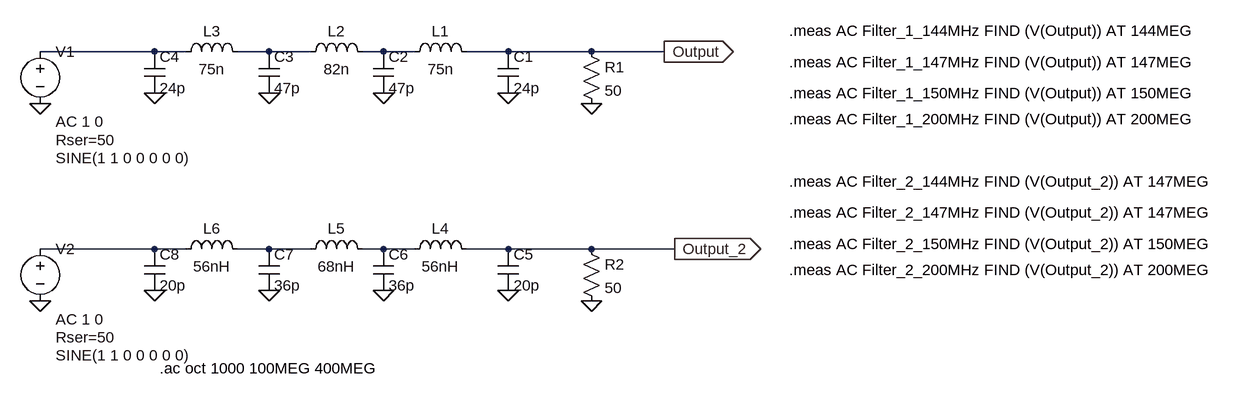
[diagram p0: schematic FilterModel.asc]
FilterModel.asc, the LTspice schematic file:
Version 4
SHEET 1 1464 680
WIRE -224 64 -400 64
WIRE -176 64 -224 64
WIRE -48 64 -96 64
WIRE 16 64 -48 64
WIRE 128 64 96 64
WIRE 176 64 128 64
WIRE 320 64 256 64
WIRE 448 64 320 64
WIRE 560 64 448 64
WIRE -224 368 -400 368
WIRE -176 368 -224 368
WIRE -48 368 -96 368
WIRE 16 368 -48 368
WIRE 128 368 96 368
WIRE 176 368 128 368
WIRE 320 368 256 368
WIRE 448 368 320 368
WIRE 576 368 448 368
FLAG 320 128 0
FLAG 128 128 0
FLAG -48 128 0
FLAG -224 128 0
FLAG -400 144 0
FLAG 448 144 0
FLAG 320 432 0
FLAG 128 432 0
FLAG -48 432 0
FLAG -224 432 0
FLAG -400 448 0
FLAG 448 448 0
FLAG 560 64 Output
IOPIN 560 64 Out
FLAG 576 368 Output_2
IOPIN 576 368 Out
SYMBOL cap 304 64 R0
SYMATTR InstName C1
SYMATTR Value 24p
SYMBOL ind 160 80 R270
WINDOW 0 32 56 VTop 2
WINDOW 3 5 56 VBottom 2
SYMATTR InstName L1
SYMATTR Value 75n
SYMATTR SpiceLine Cpar=0
SYMBOL ind 0 80 R270
WINDOW 0 32 56 VTop 2
WINDOW 3 5 56 VBottom 2
SYMATTR InstName L2
SYMATTR Value 82n
SYMBOL ind -192 80 R270
WINDOW 0 32 56 VTop 2
WINDOW 3 5 56 VBottom 2
SYMATTR InstName L3
SYMATTR Value 75n
SYMBOL cap 112 64 R0
SYMATTR InstName C2
SYMATTR Value 47p
SYMBOL cap -64 64 R0
SYMATTR InstName C3
SYMATTR Value 47p
SYMBOL cap -240 64 R0
SYMATTR InstName C4
SYMATTR Value 24p
SYMBOL voltage -400 48 R0
WINDOW 3 24 180 Left 2
WINDOW 123 24 124 Left 2
WINDOW 39 24 152 Left 2
SYMATTR Value SINE(1 1 0 0 0 0 0)
SYMATTR Value2 AC 1 0
SYMATTR SpiceLine Rser=50
SYMATTR InstName V1
SYMBOL res 432 48 R0
SYMATTR InstName R1
SYMATTR Value 50
SYMBOL cap 304 368 R0
SYMATTR InstName C5
SYMATTR Value 20p
SYMBOL ind 160 384 R270
WINDOW 0 32 56 VTop 2
WINDOW 3 5 56 VBottom 2
SYMATTR InstName L4
SYMATTR Value 56nH
SYMATTR SpiceLine Cpar=0
SYMBOL ind 0 384 R270
WINDOW 0 32 56 VTop 2
WINDOW 3 5 56 VBottom 2
SYMATTR InstName L5
SYMATTR Value 68nH
SYMBOL ind -192 384 R270
WINDOW 0 32 56 VTop 2
WINDOW 3 5 56 VBottom 2
SYMATTR InstName L6
SYMATTR Value 56nH
SYMBOL cap 112 368 R0
SYMATTR InstName C6
SYMATTR Value 36p
SYMBOL cap -64 368 R0
SYMATTR InstName C7
SYMATTR Value 36p
SYMBOL cap -240 368 R0
SYMATTR InstName C8
SYMATTR Value 20p
SYMBOL voltage -400 352 R0
WINDOW 3 24 180 Left 2
WINDOW 123 24 124 Left 2
WINDOW 39 24 152 Left 2
SYMATTR Value SINE(1 1 0 0 0 0 0)
SYMATTR Value2 AC 1 0
SYMATTR SpiceLine Rser=50
SYMATTR InstName V2
SYMBOL res 432 352 R0
SYMATTR InstName R2
SYMATTR Value 50
TEXT -216 552 Left 2 !.ac oct 1000 100MEG 400MEG
TEXT 752 32 Left 2 !.meas AC Filter_1_144MHz FIND (V(Output)) AT 144MEG
TEXT 752 80 Left 2 !.meas AC Filter_1_147MHz FIND (V(Output)) AT 147MEG
TEXT 752 168 Left 2 !.meas AC Filter_1_200MHz FIND (V(Output)) AT 200MEG
TEXT 752 128 Left 2 !.meas AC Filter_1_150MHz FIND (V(Output)) AT 150MEG
TEXT 752 264 Left 2 !.meas AC Filter_2_144MHz FIND (V(Output_2)) AT 147MEG
TEXT 752 312 Left 2 !.meas AC Filter_2_147MHz FIND (V(Output_2)) AT 147MEG
TEXT 752 400 Left 2 !.meas AC Filter_2_200MHz FIND (V(Output_2)) AT 200MEG
TEXT 752 360 Left 2 !.meas AC Filter_2_150MHz FIND (V(Output_2)) AT 150MEG

The netlist it stands for:
* FilterModel.asc
C1 Output 0 24p
L1 N003 Output 75n Cpar=0
L2 N002 N003 82n
L3 N001 N002 75n
C2 N003 0 47p
C3 N002 0 47p
C4 N001 0 24p
V1 N001 0 SINE(1 1 0 0 0 0 0) AC 1 0 Rser=50
R1 Output 0 50
C5 Output_2 0 20p
L4 N006 Output_2 56nH Cpar=0
L5 N005 N006 68nH
L6 N004 N005 56nH
C6 N006 0 36p
C7 N005 0 36p
C8 N004 0 20p
V2 N004 0 SINE(1 1 0 0 0 0 0) AC 1 0 Rser=50
R2 Output_2 0 50
.ac oct 1000 100MEG 400MEG
.meas AC Filter_1_144MHz FIND (V(Output)) AT 144MEG
.meas AC Filter_1_147MHz FIND (V(Output)) AT 147MEG
.meas AC Filter_1_200MHz FIND (V(Output)) AT 200MEG
.meas AC Filter_1_150MHz FIND (V(Output)) AT 150MEG
.meas AC Filter_2_144MHz FIND (V(Output_2)) AT 147MEG
.meas AC Filter_2_147MHz FIND (V(Output_2)) AT 147MEG
.meas AC Filter_2_200MHz FIND (V(Output_2)) AT 200MEG
.meas AC Filter_2_150MHz FIND (V(Output_2)) AT 150MEG
.backanno
.end